# EAGLE design Power4x4r2 (EAGLE 6.2)
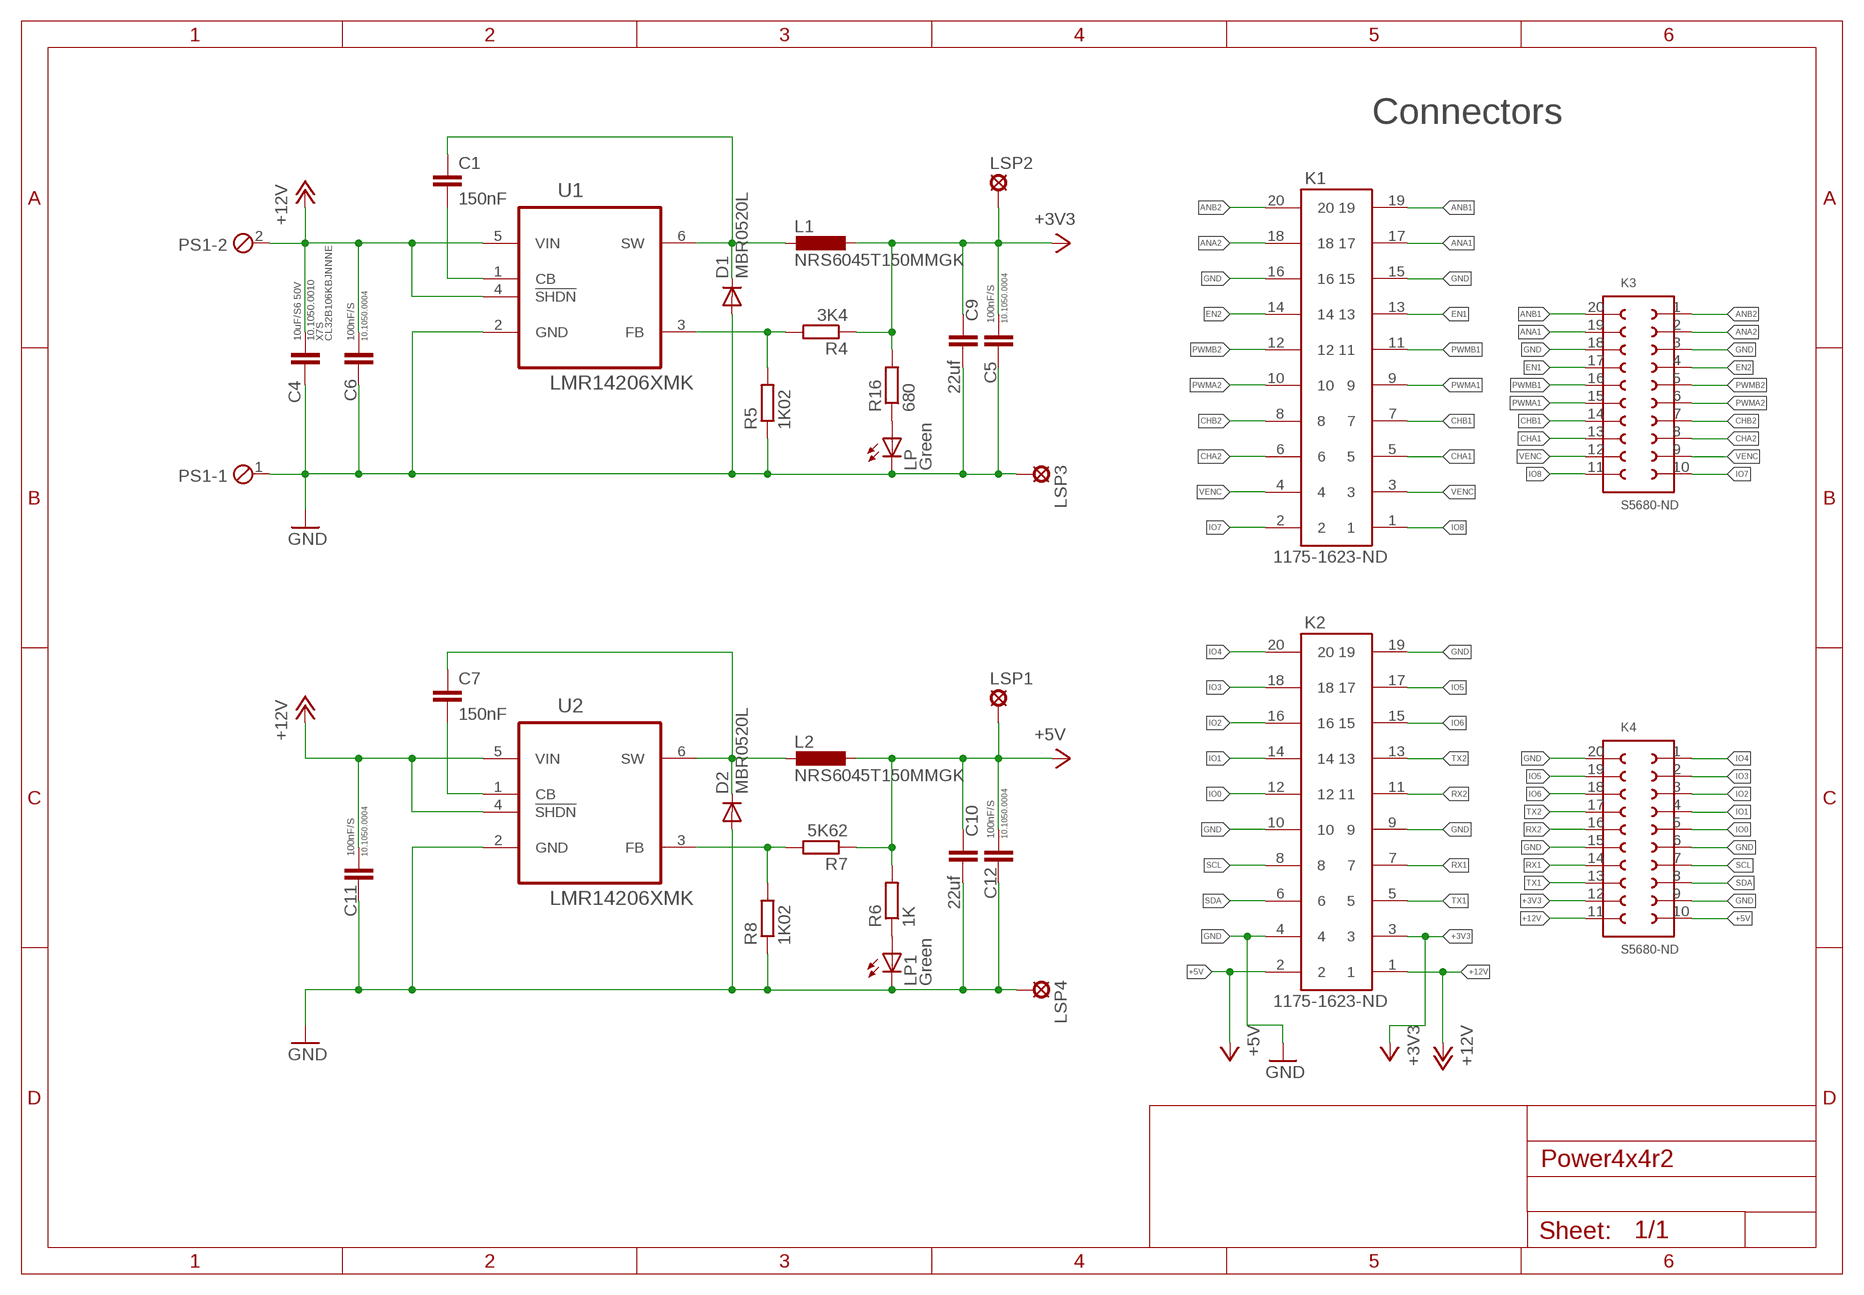
[diagram p0: schematic, sheet 1]

## Parts
C1  150nF  C-EUC0805K  [C0805K]
C4  10uF/S6 50V  C-EUC3225  [C3225]
C5  100nF/S  C-EUC0805  [C0805]
C6  100nF/S  C-EUC0805  [C0805]
C7  150nF  C-EUC0805K  [C0805K]
C9  22uf  C-EUC1206  [C1206]
C10  22uf  C-EUC1206  [C1206]
C11  100nF/S  C-EUC0805  [C0805]
C12  100nF/S  C-EUC0805  [C0805]
D1  MBR0520L  DIODE-SOD123  [SOD123]
D2  MBR0520L  DIODE-SOD123  [SOD123]
K1  1175-1623-ND  612X2020621  [612X2020621]
K2  1175-1623-ND  612X2020621  [612X2020621]
K3  S5680-ND  61002021821  [61002021821]
K4  S5680-ND  61002021821  [61002021821]
L1  NRS6045T150MMGK  L-EUWE-TPC  [POWER-CHOKE_WE-TPC]
L2  NRS6045T150MMGK  L-EUWE-TPC  [POWER-CHOKE_WE-TPC]
LP  Green  LEDCHIPLED_0805  [CHIPLED_0805]
LP1  Green  LEDCHIPLED_0805  [CHIPLED_0805]
LSP1  LSP10  [LSP10]
LSP2  LSP10  [LSP10]
LSP3  LSP10  [LSP10]
LSP4  LSP10  [LSP10]
PS1  MPT2  [2POL254]
R4  3K4  R-EU_R0805  [R0805]
R5  1K02  R-EU_R0805  [R0805]
R6  1K  R-EU_R0603  [R0603]
R7  5K62  R-EU_R0805  [R0805]
R8  1K02  R-EU_R0805  [R0805]
R16  680  R-EU_R0603  [R0603]
U1  LMR14206XMK  [SOT95P280X110-6N]
U2  LMR14206XMK  [SOT95P280X110-6N]

## Nets
+3V3: C5.2 C9.1 K2.3 K4.12 L1.1 LSP2.MP R4.1 R16.2
+5V: C10.1 C12.2 K2.2 K4.10 L2.1 LSP1.MP R6.2 R7.1
+12V: C4.1 C6.2 C11.2 K2.1 K4.11 PS1.2 U1.4(!SHDN) U1.5(VIN) U2.4(!SHDN) U2.5(VIN)
ANA1: K1.17 K3.19
ANA2: K1.18 K3.2
ANB1: K1.19 K3.20
ANB2: K1.20 K3.1
CHA1: K1.5 K3.13
CHA2: K1.6 K3.8
CHB1: K1.7 K3.14
CHB2: K1.8 K3.7
EN1: K1.13 K3.17
EN2: K1.14 K3.4
GND: C4.2 C5.1 C6.1 C9.2 C10.2 C11.1 C12.1 D1.A D2.A K1.15 K1.16 K2.4 K2.9 K2.10 K2.19 K3.3 K3.18 K4.6 K4.9 K4.15 K4.20 LP1.C LP.C LSP3.MP LSP4.MP PS1.1 R5.1 R8.1 U1.2(GND) U2.2(GND)
IO0: K2.12 K4.5
IO1: K2.14 K4.4
IO2: K2.16 K4.3
IO3: K2.18 K4.2
IO4: K2.20 K4.1
IO5: K2.17 K4.19
IO6: K2.15 K4.18
IO7: K1.2 K3.10
IO8: K1.1 K3.11
N$1: C1.2 U1.1(CB)
N$2: C1.1 D1.C L1.2 U1.6(SW)
N$3: LP1.A R6.1
N$4: R4.2 R5.2 U1.3(FB)
N$5: LP.A R16.1
N$6: C7.2 U2.1(CB)
N$7: C7.1 D2.C L2.2 U2.6(SW)
N$8: R7.2 R8.2 U2.3(FB)
PWMA1: K1.9 K3.15
PWMA2: K1.10 K3.6
PWMB1: K1.11 K3.16
PWMB2: K1.12 K3.5
RX1: K2.7 K4.14
RX2: K2.11 K4.16
SCL: K2.8 K4.7
SDA: K2.6 K4.8
TX1: K2.5 K4.13
TX2: K2.13 K4.17
VENC: K1.3 K1.4 K3.9 K3.12

## Notes on the sheet
- Connectors

## Library data of the parts
C1 C7 C9 C10 = rcl:C-EU: CAPACITOR, European symbol
C4 = rcl:C-EU: CAPACITOR, European symbol; CASE: C3225 [EIA CC1210]; CODE: CL32B106KBJNNNE; KATODO: 10.1050.0010; TEMPERATURE: X7S
C5 C6 C11 C12 = rcl:C-EU: CAPACITOR, European symbol; KATODO: 10.1050.0004
D1 D2 = diode:DIODE-: DIODE; DIGIKEY: MBR0520LCT-ND
K1 K2 = Wuerth_Elektronik_eiCan_Wire_to_Board_Connectors:612X2020621: WR-BHD 2.54mm Male SMT Box Header High Temperature, 20 Pins=>Code : Con_WTB_BHD_2.54_Male_SMT_612X2020621 <http://katalog.we-online.de/media/thumbs2/eican/thb_Con_WTB_BHD_2.54_Male_SMT_6120xx20621_pf2.jpg> Details see: http://katalog.we-online.de/en/em/612_0xx_206_21 Created 2014-06-05, Karrer Zheng 2014 (C) Würth Elektronik
K3 K4 = Wuerth_Elektronik_eiCan_Board_to_Board_Connectors:61002021821: WR-PHD 2.54mm Dual SMT Socket Header, 20 Pins=>Code : Con_BTB_SHD_2.54_1_SMT_61002021821 <http://katalog.we-online.de/media/images/eican/Con_BTB_SHD_2.54_1_SMT_6100xx21821_pf2.jpg> Details see: http://katalog.we-online.de/en/em/610_0xx_218_21 Created 2014-05-30, Karrer Zheng 2014 (C) Würth Elektronik
L1 L2 = rcl:L-EU: INDUCTOR, European symbol; DIGIKEY: 587-2948-1-ND
LP LP1 = led:LED: LED OSRAM: - CHIPLED LG R971, LG N971, LY N971, LG Q971, LY Q971, LO R971, LY R971 LH N974, LH R974 LS Q976, LO Q976, LY Q976 LO Q996 - Hyper CHIPLED LW Q18S LB Q993, LB Q99A, LB R99A - SideLED LS A670, LO A670, LY A670, LG A670, LP A670 LB A673, LV A673, LT A673, LW A673 LH A674 LY A675 LS A676, LA A676, LO A676, LY A676, LW A676 LS A679, LY A679, LG A679 - Hyper Micro SIDELED® LS Y876, LA Y876, LO Y876, LY Y876 LT Y87S - SmartLED LW L88C, LW L88S LB L89C, LB L89S, LG L890 LS L89K, LO L89K, LY L89K LS L896, LA L896, LO L896, LY L896 - TOPLED LS T670, LO T670, LY T670, LG T670, LP T670 LSG T670, LSP T670, LSY T670, LOP T670, LYG T670 LG T671, LOG T671, LSG T671 LB T673, LV T673, LT T673, LW T673 LH T674 LS T676, LA T676, LO T676, LY T676, LB T676, LH T676, LSB T676, LW T676 LB T67C, LV T67C, LT T67C, LS T67K, LO T67K, LY T67K, LW E67C LS E67B, LA E67B, LO E67B, LY E67B, LB E67C, LV E67C, LT E67C LW T67C LS T679, LY T679, LG T679 LS T770, LO T770, LY T770, LG T770, LP T770 LB T773, LV T773, LT T773, LW T773 LH T774 LS E675, LA E675, LY E675, LS T675 LS T776, LA T776, LO T776, LY T776, LB T776 LHGB T686 LT T68C, LB T68C - Hyper Mini TOPLED® LB M676 - Mini TOPLED Santana® LG M470 LS M47K, LO M47K, LY M47K Source: http://www.osram.convergy.de LUXEON: - LUMILED® LXK2-PW12-R00, LXK2-PW12-S00, LXK2-PW14-U00, LXK2-PW14-V00 LXK2-PM12-R00, LXK2-PM12-S00, LXK2-PM14-U00 LXK2-PE12-Q00, LXK2-PE12-R00, LXK2-PE12-S00, LXK2-PE14-T00, LXK2-PE14-U00 LXK2-PB12-K00, LXK2-PB12-L00, LXK2-PB12-M00, LXK2-PB14-N00, LXK2-PB14-P00, LXK2-PB14-Q00 LXK2-PR12-L00, LXK2-PR12-M00, LXK2-PR14-Q00, LXK2-PR14-R00 LXK2-PD12-Q00, LXK2-PD12-R00, LXK2-PD12-S00 LXK2-PH12-R00, LXK2-PH12-S00 LXK2-PL12-P00, LXK2-PL12-Q00, LXK2-PL12-R00 Source: www.luxeon.com KINGBRIGHT: KA-3528ASYC Source: www.kingbright.com
LSP1-LSP4 = solpad:LSP10: SOLDER PAD drill 1.0 mm, distributor Buerklin, 12H555
PS1 = Personale:MPT2: PHOENIX CONNECTOR
R4-R8 R16 = rcl:R-EU_: RESISTOR, European symbol
U1 U2 = LMR14206:LMR14206XMK: IC, SIMPLE SWITCHER 42Vin, 0.6A Step-Down Voltage Regulator in SOT-23-6; DIGIKEY: LMR14206XMKE/NOPBCT-ND; MPN: LMR14206XMK; OC_FARNELL: 2064681; OC_NEWARK: 75T7397; PACKAGE: SOT-23-6; SUPPLIER: TEXAS INSTRUMENTS

## Net classes
1 power: width 0.305 mm, clearance 0.203 mm

## Board
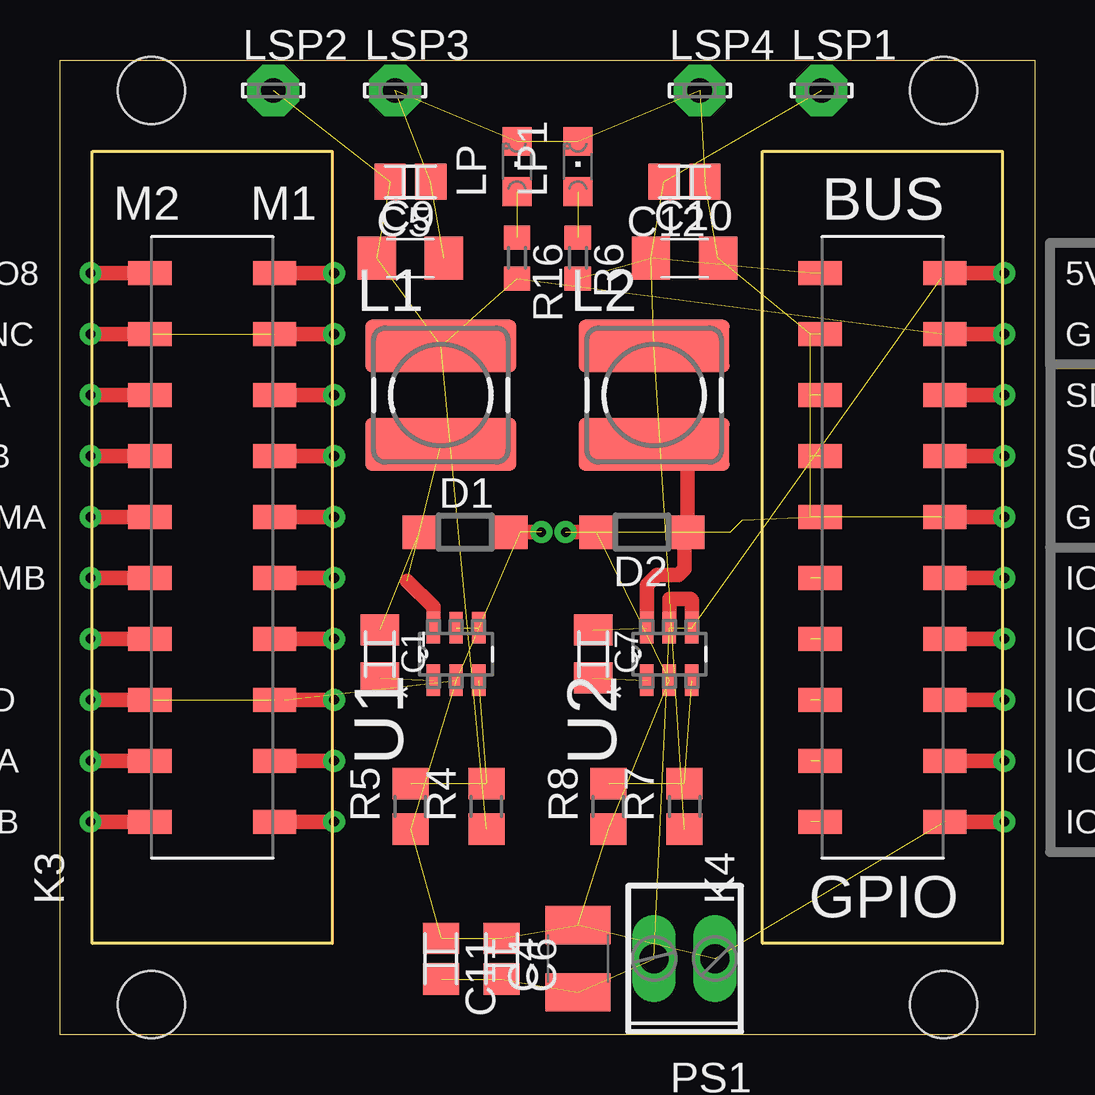
[diagram p1: board, top side]
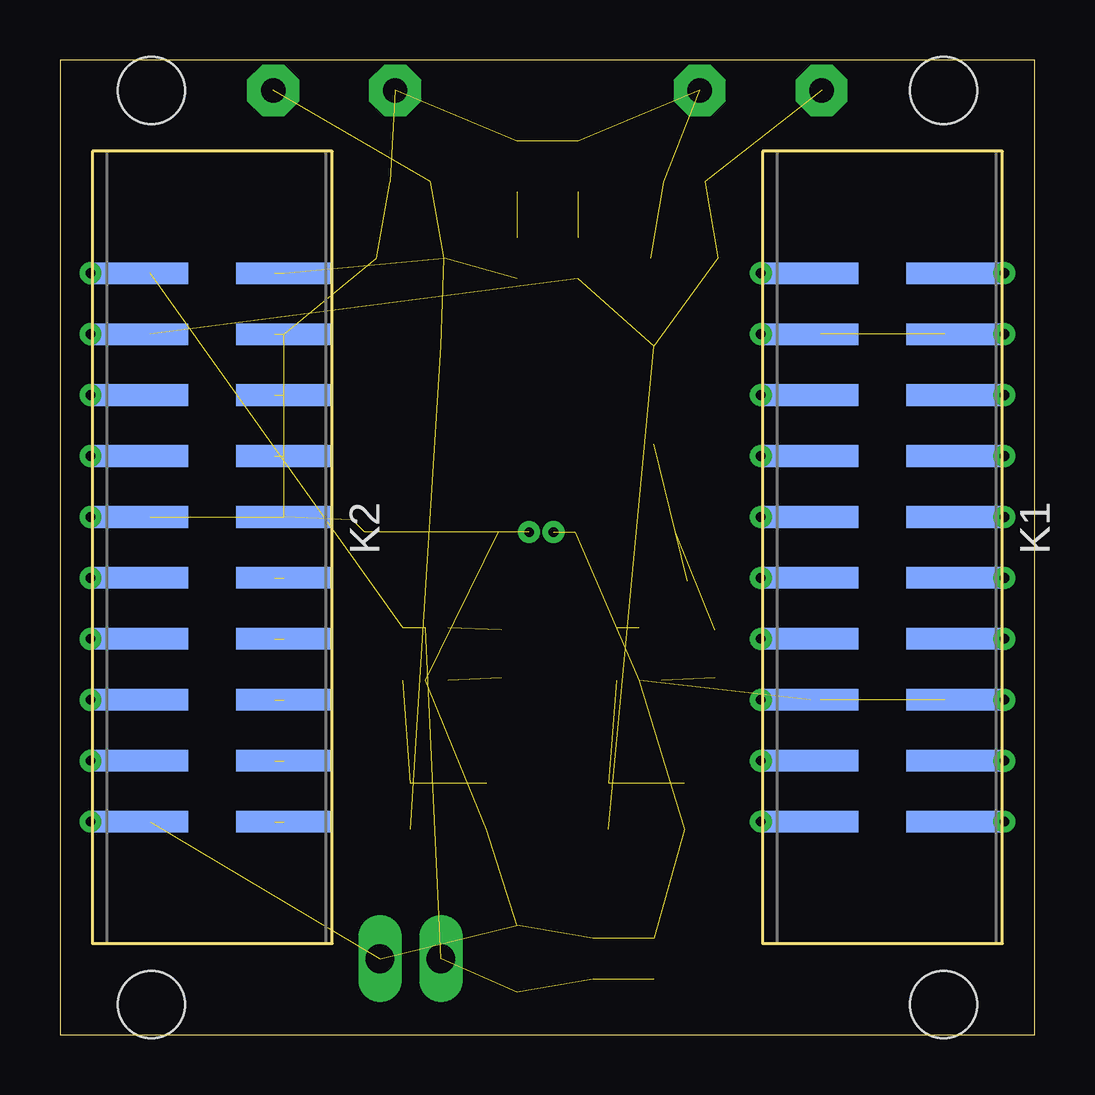
[diagram p2: board, bottom side, seen from below]

Size 40.64 x 40.64 mm. Coordinates in mm from the lower left corner, seen from the top.
Outline: 40.64,40.64 40.64,0 0,0 0,40.64 40.64,40.64
Copper layers (1*16): Top 0.035mm / dielectric 1.5mm / Bottom 0.035mm
Design rules "default": minimum track width 8mil, minimum drill 20mil, track to track 8mil, track to pad 8mil, pad to pad 8mil, via to via 8mil, smd to smd 8mil, copper to edge 10mil, drill to drill 8mil, minimum pad ring 12mil, minimum via ring 10mil, stop-mask expansion 4mil, vias tented up to drill 25mil, thermal gap 10mil
Holes 2.8 mm at 3.81,39.37 36.83,1.27 36.83,39.37 3.81,1.27
tRestrict: area -0.3,-1.9 to 42.9,0.6; area -0.3,41.9 to 42.9,44.5; area -1.9,0 to 0.6,43.2; area 41.6,0 to 44.1,43.2
bRestrict: area -1.9,0 to 0.6,43.2; area 41.6,0 to 44.1,43.2; area -0.3,-1.9 to 42.9,0.6; area -0.3,41.9 to 42.9,44.5

### Footprints (pad centres in the part's own frame; a part is rotated, then mirrored left to right if it is on the bottom)
C0805K = smd 1.3 x 1.6: 1 -1,0; 2 1,0
C3225 = smd 1.6 x 2.7: 1 -1.4,0; 2 1.4,0
C0805 = smd 1.3 x 1.5: 1 -0.85,0; 2 0.85,0
C1206 = smd 1.6 x 1.8: 1 -1.4,0; 2 1.4,0
SOD123 = smd 1.4 x 1.4: A 1.9,0; C -1.9,0
612X2020621 = smd 0.9 x 4: 1 0,-3; 2 0,3; 3 2.54,-3; 4 2.54,3; 5 5.08,-3; 6 5.08,3; 7 7.62,-3; 8 7.62,3; 9 10.16,-3; 10 10.16,3; 11 12.7,-3; 12 12.7,3; 13 15.24,-3; 14 15.24,3; 15 17.78,-3; 16 17.78,3; 17 20.32,-3; 18 20.32,3; 19 22.86,-3; 20 22.86,3
61002021821 = smd 1 x 1.8: 1 -11.43,2.6; 2 -8.89,2.6; 3 -6.35,2.6; 4 -3.81,2.6; 5 -1.27,2.6; 6 1.27,2.6; 7 3.81,2.6; 8 6.35,2.6; 9 8.89,2.6; 10 11.43,2.6; 11 11.43,-2.6; 12 8.89,-2.6; 13 6.35,-2.6; 14 3.81,-2.6; 15 1.27,-2.6; 16 -1.27,-2.6; 17 -3.81,-2.6; 18 -6.35,-2.6; 19 -8.89,-2.6; 20 -11.43,-2.6
POWER-CHOKE_WE-TPC = smd 6.3 x 2.2: 1 0,2.05; 2 0,-2.05
CHIPLED_0805 = smd 1.2 x 1.2: A 0,-1.05; C 0,1.05
LSP10 = drill 1.016 pad 2.159 octagon: MP 0,0
2POL254 = drill 1.2 long: 1 -1.27,0; 2 1.27,0
R0805 = smd 1.3 x 1.5: 1 -0.95,0; 2 0.95,0
R0603 = smd 1 x 1.1: 1 -0.85,0; 2 0.85,0
SOT95P280X110-6N = smd 1.321 x 0.559: 1 -1.092,0.94; 2 -1.092,0; 3 -1.092,-0.94; 4 1.092,-0.94; 5 1.092,0; 6 1.092,0.94

### Placement (x,y rotation side)
C1  13.34,15.88 270 top
C4  21.59,3.17 90 top
C5  14.61,35.56 180 top
C6  18.41,3.17 270 top
C7  22.23,15.88 270 top
C9  14.61,32.38 0 top
C10  26.04,32.38 0 top
C11  15.88,3.17 270 top
C12  26.04,35.56 180 top
D1  16.89,20.95 0 top
D2  24.26,20.95 180 top
K1  6.35,31.75 270 bottom
K2  34.29,31.75 270 bottom
K3  6.35,20.32 90 top
K4  34.29,20.32 90 top
L1  15.88,26.67 0 top
L2  24.77,26.67 0 top
LP  19.05,36.2 0 top
LP1  21.59,36.2 0 top
LSP1  31.75,39.37 0 top
LSP2  8.89,39.37 0 top
LSP3  13.97,39.37 0 top
LSP4  26.67,39.37 0 top
PS1  26.04,3.17 180 top
R4  17.78,9.53 90 top
R5  14.61,9.53 90 top
R6  21.59,32.38 270 top
R7  26.04,9.53 90 top
R8  22.86,9.53 90 top
R16  19.05,32.38 270 top
U1  16.51,15.88 90 top
U2  25.4,15.88 90 top

### Tracks (layer width: path | path; a pad name or v marks a point on that pad's centre or on a via)
+3V3  (via drill 0.41)  (6 unrouted)
  Top 0.61: v39.37,29.21 K4.12
  Bottom 0.61: K2.3 v39.37,29.21
+5V  (7 unrouted)
+12V  (via drill 0.41)  (7 unrouted)
  Top 0.61: v39.37,31.75 K4.11 | U2.5 25.4,18.16 26.29,18.16 26.34,18.11 U2.4
  Bottom 0.61: K2.1 v39.37,31.75
ANA1  (via drill 0.41)
  Top 0.61: v11.43,11.43 K3.19
  Bottom 0.61: K1.17 v11.43,11.43
ANA2  (via drill 0.41)
  Top 0.61: v1.27,11.43 K3.2
  Bottom 0.61: K1.18 v1.27,11.43
ANB1  (via drill 0.41)
  Top 0.61: K3.20 v11.43,8.89
  Bottom 0.61: v11.43,8.89 K1.19
ANB2  (via drill 0.41)
  Top 0.61: v1.27,8.89 K3.1
  Bottom 0.61: K1.20 v1.27,8.89
CHA1  (via drill 0.41)
  Top 0.61: K3.13 v11.43,26.67
  Bottom 0.61: v11.43,26.67 K1.5
CHA2  (via drill 0.41)
  Top 0.61: v1.27,26.67 K3.8
  Bottom 0.61: K1.6 v1.27,26.67
CHB1  (via drill 0.41)
  Top 0.61: v11.43,24.13 K3.14
  Bottom 0.61: K1.7 v11.43,24.13
CHB2  (via drill 0.41)
  Top 0.61: v1.27,24.13 K3.7
  Bottom 0.61: K1.8 v1.27,24.13
EN1  (via drill 0.41)
  Top 0.61: v11.43,16.51 K3.17
  Bottom 0.61: K1.13 v11.43,16.51
EN2  (via drill 0.41)
  Top 0.61: v1.27,16.51 K3.4
  Bottom 0.61: K1.14 v1.27,16.51
GND  (via drill 0.41)  (28 unrouted)
  Top 0.61: v1.27,13.97 K3.3 | K3.18 v11.43,13.97 | v39.37,21.59 K4.15 | K4.20 v39.37,8.89 | D1.A v20.07,20.95 | D2.A v21.08,20.95
  Bottom 0.61: K1.16 v1.27,13.97 | v11.43,13.97 K1.15 | K2.9 v39.37,21.59 | v39.37,8.89 K2.19
IO0  (1 unrouted)
IO1  (1 unrouted)
IO2  (1 unrouted)
IO3  (1 unrouted)
IO4  (1 unrouted)
IO5  (via drill 0.41)
  Top 0.61: v39.37,11.43 K4.19
  Bottom 0.61: K2.17 v39.37,11.43
IO6  (via drill 0.41)
  Top 0.61: v39.37,13.97 K4.18
  Bottom 0.61: K2.15 v39.37,13.97
IO7  (via drill 0.41)
  Top 0.61: K3.10 v1.27,31.75
  Bottom 0.61: v1.27,31.75 K1.2
IO8  (via drill 0.41)
  Top 0.61: v11.43,31.75 K3.11
  Bottom 0.61: K1.1 v11.43,31.75
N$1  (1 unrouted)
N$2  (3 unrouted)
  Top 0.61: U1.6 15.57,17.83 14.48,18.92
N$3  (1 unrouted)
N$4  (2 unrouted)
N$5  (1 unrouted)
N$6  (1 unrouted)
N$7  (1 unrouted)
  Top 0.61: U2.6 24.46,18.75 24.89,19.18 25.78,19.18 26.04,19.43 26.04,20.83 D2.C 26.16,24.39 25.91,24.64 24.78,24.64 L2.2
N$8  (2 unrouted)
PWMA1  (via drill 0.41)
  Top 0.61: v11.43,21.59 K3.15
  Bottom 0.61: K1.9 v11.43,21.59
PWMA2  (via drill 0.41)
  Top 0.61: v1.27,21.59 K3.6
  Bottom 0.61: K1.10 v1.27,21.59
PWMB1  (via drill 0.41)
  Top 0.61: v11.43,19.05 K3.16
  Bottom 0.61: K1.11 v11.43,19.05
PWMB2  (via drill 0.41)
  Top 0.61: K3.5 v1.27,19.05
  Bottom 0.61: v1.27,19.05 K1.12
RX1  (via drill 0.41)
  Top 0.61: v39.37,24.13 K4.14
  Bottom 0.61: K2.7 v39.37,24.13
RX2  (via drill 0.41)
  Top 0.61: v39.37,19.05 K4.16
  Bottom 0.61: K2.11 v39.37,19.05
SCL  (1 unrouted)
SDA  (1 unrouted)
TX1  (via drill 0.41)
  Top 0.61: K4.13 v39.37,26.67
  Bottom 0.61: v39.37,26.67 K2.5
TX2  (via drill 0.41)
  Top 0.61: K4.17 v39.37,16.51
  Bottom 0.61: v39.37,16.51 K2.13
VENC  (via drill 0.41)  (1 unrouted)
  Top 0.61: K3.9 v1.27,29.21 | v11.43,29.21 K3.12
  Bottom 0.61: v1.27,29.21 K1.4 | K1.3 v11.43,29.21

### Text on the board
tPlace: M2 | M1 | BUS | IO7 | IO8 | 5V | 12V | VENC | GND | 3v | CHA | SDA | TX1 | CHB | SCL | RX1 | PWMA | GND | GND | PWMB | IO0 | RX2 | EN | IO1 | TX2 | GND | IO2 | IO6 | AN A | IO3 | IO5 | AN B | IO4 | GND | GPIO